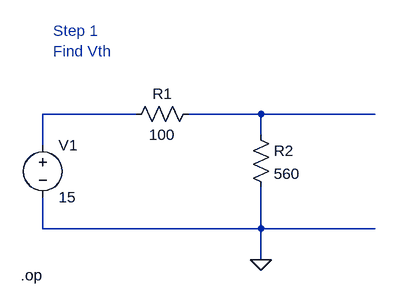
[diagram p0: schematic EEE_1_2.asc]
EEE_1_2.asc, the LTspice schematic file:
Version 4
SHEET 1 880 680
WIRE 128 64 -16 64
WIRE 320 64 208 64
WIRE 496 64 320 64
WIRE 320 96 320 64
WIRE -16 112 -16 64
WIRE -16 240 -16 192
WIRE 320 240 320 176
WIRE 320 240 -16 240
WIRE 496 240 320 240
WIRE 320 288 320 240
FLAG 320 288 0
SYMBOL voltage -16 96 R0
SYMATTR InstName V1
SYMATTR Value 15
SYMBOL res 224 48 R90
WINDOW 0 0 56 VBottom 2
WINDOW 3 32 56 VTop 2
SYMATTR InstName R1
SYMATTR Value 100
SYMBOL res 304 80 R0
SYMATTR InstName R2
SYMATTR Value 560
TEXT 0 -64 Left 2 ;Step 1\nFind Vth
TEXT -50 312 Left 2 !.op

The netlist it stands for:
* EEE_1_2.asc
V1 N001 0 15
R1 N002 N001 100
R2 N002 0 560
* Step 1
* Find Vth
.op
.backanno
.end